# Altium schematic sheet SIMO_SWITCHER.SchDoc
size A4; ApprovedBy: Mateusz Kowalik; CheckedBy: Mateusz Kowalik; Author: Mateusz Kowalik; CompanyName: InMotion Labs sp. z o.o.; DrawnBy: Mateusz Kowalik; Engineer: Mateusz Kowalik; Organization: InMotion Labs sp. z o.o.; Address1: Rydlówka 5A; Address2: 30-363 Kraków; Address4: Poland; DocumentNumber: 8; Revision: Rev 0; SheetNumber: 7; SheetTotal: 17
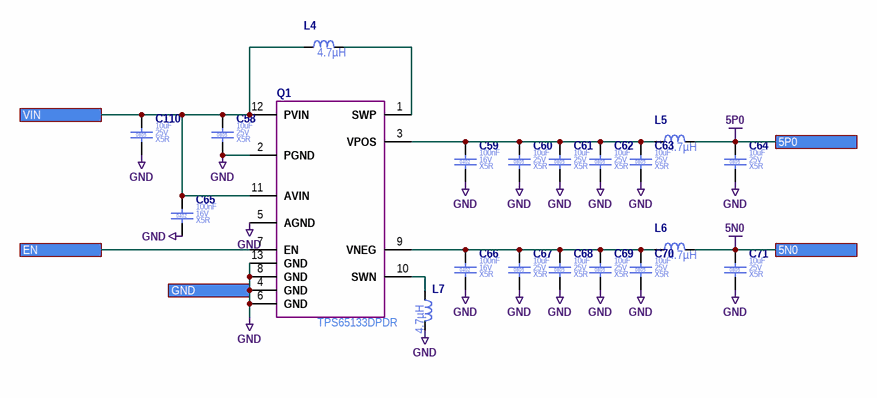
[diagram p0: SIMO_SWITCHER.SchDoc]

## Parts
C58  Case/Package: 0805  Voltage Rating (DC): 25V  Dielectric: X5R  Capacitance: 10uF  [C_0805_2012]  (hidden comment: C_10UF_25V_X5R_0805_10)
C59  Case/Package: 0402  Voltage Rating (DC): 16V  Dielectric: X5R  Capacitance: 100nF  [C_0402_1005]  (hidden comment: C_100NF_16V_X5R_0402_10)
C60  Case/Package: 0805  Voltage Rating (DC): 25V  Dielectric: X5R  Capacitance: 10uF  [C_0805_2012]  (hidden comment: C_10UF_25V_X5R_0805_10)
C61  Case/Package: 0805  Voltage Rating (DC): 25V  Dielectric: X5R  Capacitance: 10uF  [C_0805_2012]  (hidden comment: C_10UF_25V_X5R_0805_10)
C62  Case/Package: 0805  Voltage Rating (DC): 25V  Dielectric: X5R  Capacitance: 10uF  [C_0805_2012]  (hidden comment: C_10UF_25V_X5R_0805_10)
C63  Case/Package: 0805  Voltage Rating (DC): 25V  Dielectric: X5R  Capacitance: 10uF  [C_0805_2012]  (hidden comment: C_10UF_25V_X5R_0805_10)
C64  Case/Package: 0805  Voltage Rating (DC): 25V  Dielectric: X5R  Capacitance: 10uF  [C_0805_2012]  (hidden comment: C_10UF_25V_X5R_0805_10)
C65  Case/Package: 0402  Voltage Rating (DC): 16V  Dielectric: X5R  Capacitance: 100nF  [C_0402_1005]  (hidden comment: C_100NF_16V_X5R_0402_10)
C66  Case/Package: 0402  Voltage Rating (DC): 16V  Dielectric: X5R  Capacitance: 100nF  [C_0402_1005]  (hidden comment: C_100NF_16V_X5R_0402_10)
C67  Case/Package: 0805  Voltage Rating (DC): 25V  Dielectric: X5R  Capacitance: 10uF  [C_0805_2012]  (hidden comment: C_10UF_25V_X5R_0805_10)
C68  Case/Package: 0805  Voltage Rating (DC): 25V  Dielectric: X5R  Capacitance: 10uF  [C_0805_2012]  (hidden comment: C_10UF_25V_X5R_0805_10)
C69  Case/Package: 0805  Voltage Rating (DC): 25V  Dielectric: X5R  Capacitance: 10uF  [C_0805_2012]  (hidden comment: C_10UF_25V_X5R_0805_10)
C70  Case/Package: 0805  Voltage Rating (DC): 25V  Dielectric: X5R  Capacitance: 10uF  [C_0805_2012]  (hidden comment: C_10UF_25V_X5R_0805_10)
C71  Case/Package: 0805  Voltage Rating (DC): 25V  Dielectric: X5R  Capacitance: 10uF  [C_0805_2012]  (hidden comment: C_10UF_25V_X5R_0805_10)
C110  Case/Package: 0805  Voltage Rating (DC): 25V  Dielectric: X5R  Capacitance: 10uF  [C_0805_2012]  (hidden comment: C_10UF_25V_X5R_0805_10)
L4  Inductance: 4.7µH  [L_1008_2520]  (hidden comment: 1239AS-H-4R7M=P2)
L5  Inductance: 4.7µH  [L_1008_2520]  (hidden comment: 1239AS-H-4R7M=P2)
L6  Inductance: 4.7µH  [L_1008_2520]  (hidden comment: 1239AS-H-4R7M=P2)
L7  Inductance: 4.7µH  [L_1008_2520]  (hidden comment: 1239AS-H-4R7M=P2)
Q1  TPS65133DPDR  [SON45P300X80_HS-13N]

## Ports
5N0, 5P0, EN, GND, VIN

## Nets
5N0: C71.1 L6.2 ; port 5N0
5P0: C64.1 L5.2 ; port 5P0
GND: C58.2 C59.2 C60.2 C61.2 C62.2 C63.2 C64.2 C65.2 C66.2 C67.2 C68.2 C69.2 C70.2 C71.2 C110.2 L7.2 Q1.2(PGND) Q1.4(GND) Q1.5(AGND) Q1.6(GND) Q1.8(GND) Q1.13(GND) ; port GND
EN: Q1.7(EN) ; port EN
VIN: C58.1 C65.1 C110.1 L4.1 Q1.11(AVIN) Q1.12(PVIN) ; port VIN
NetC59_1: C59.1 C60.1 C61.1 C62.1 C63.1 L5.1 Q1.3(VPOS)
NetC66_1: C66.1 C67.1 C68.1 C69.1 C70.1 L6.1 Q1.9(VNEG)
NetL4_2: L4.2 Q1.1(SWP)
NetL7_1: L7.1 Q1.10(SWN)

## Notes on the sheet
- Title
- Size:
- Date:
- A4

## Library data of the parts
C58 C60-C64 C67-C71 C110 = C_10UF_25V_X5R_0805_10: Ceramic Capacitor; Manufacturer Part Number: CL21A106KAYNNNE; Manufacturer: Samsung Electro-Mechanics; Value: 10uF; Tolerance: 10%; Part Number: C_10UF_25V_X5R_0805_10; Mount: Surface Mount; Height: 1.35mm; HelpURL: https://pl.mouser.com/datasheet/2/585/MLCC-1837944.pdf; RoHS: Compliant; Max Operating Temperature: 85°C; Status: MK; Supplier 1: Mouser; Supplier Part Number 1: 187-CL21A106KAYNNNE; Supplier 2: LCSC; Supplier Part Number 2: C15850; Manufacturer 2: Samsung Electro-Mechanics; Manufacturer Part Number 2: CL21A106KAYNNNE
C59 C65 C66 = C_100NF_16V_X5R_0402_10: Ceramic Capacitor; Manufacturer Part Number: EMK105BJ104KV-F; Manufacturer: Taiyo Yuden; Value: 100nF; Tolerance: 10%; Part Number: C_100NF_16V_X5R_0402_10; Mount: Surface Mount; Height: 500um; HelpURL: http://datasheet.octopart.com/EMK105BJ104KV-F-Taiyo-Yuden-datasheet-8857305.pdf; RoHS: Compliant; Max Operating Temperature: 125°C; Status: MK; Supplier 1: Mouser; Supplier Part Number 1: 963-EMK105BJ104KV-F; Manufacturer 2: Samsung Electro-Mechanics; Manufacturer Part Number 2: CL05B104KO5NNNC; Supplier 2: LCSC; Supplier Part Number 2: C1525
L4-L7 = 1239AS-H-4R7M=P2: Power Inductor; Manufacturer: Murata Electronics; Value: 4.7µH; DC Current: 1.5A; Tolerance: 20%; DC Resistance: 240m; Part Number: 1239AS-H-4R7M=P2; Manufacturer Part Number: 1239AS-H-4R7M=P2; Case/Package: DFE252012C; Mount: Surface Mount; Height: 1.2mm; HelpURL: https://pl.mouser.com/datasheet/2/281/product-1023181.pdf; Max Operating Temperature: 85°C; Status: MK; RoHS: Compliant; Supplier 1: Mouser; Supplier Part Number 1: 81-1239AS-H-4R7MP2
Q1 = TPS65133DPDR: Split-Rail Converter, ±5V, 250mA Dual Output Power Supply; Manufacturer: Texas Instruments; Number of Outputs: 2; Min Output Voltage: +/-5V; Min Input Voltage: 2.9V; Marking: SHY; Output Configuration: Positive,Negative; Quiescent Current: 0.1uA; Synchronous Rectifier: Yes; Manufacturer Part Number: TPS65133DPDR; Part Number: TPS65133DPDR; Max Output Current: 250mA; Max Input Voltage: 5V; Max Output Voltage: +/-5V; Max Operating Temperature: 85; HelpURL: https://www.ti.com/lit/ds/symlink/tps65133.pdf; Number of Pins: 12; RoHS: Compliant; Status: MK; Case/Package: WSON12; Supplier 1: Mouser; Supplier Part Number 1: 595-TPS65133DPDR